# EAGLE design Display-Version (EAGLE 8.7.1)
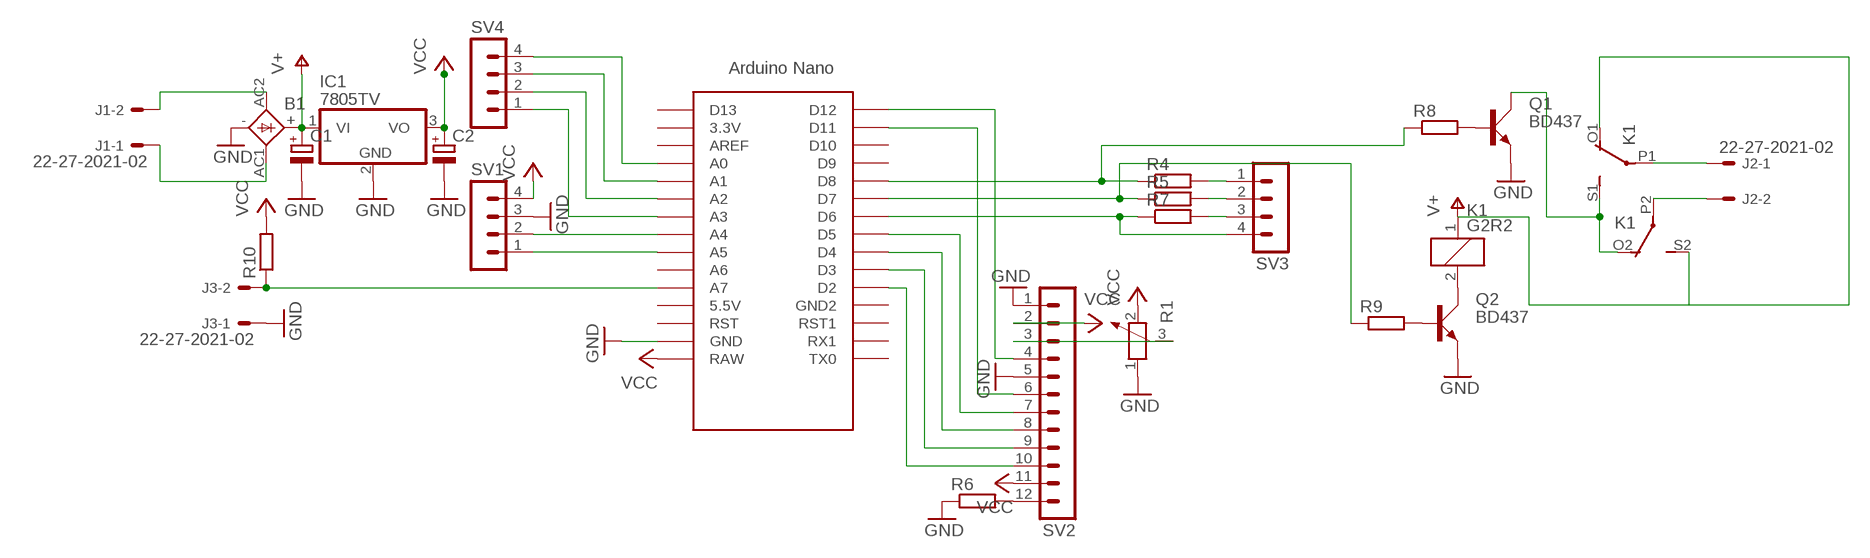
[diagram p0: schematic, sheet 1]

## Parts
B1  FBU4  [FBU4]
C1  CPOL-EUE3.5-10  [E3,5-10]
C2  CPOL-EUE2.5-6  [E2,5-6]
IC1  7805TV  [TO220V]
J1  22-27-2021-02  [6410-02]
J2  22-27-2021-02  [6410-02]
J3  22-27-2021-02  [6410-02]
K1  G2R2  [G2R2]
Q1  BD437  [TO126AV]
Q2  BD437  [TO126AV]
R1  POTENTIOMETER_PT-10S  [PT-10S]
R4  R-EU_R1206W  [R1206W]
R5  R-EU_R1206W  [R1206W]
R6  R-EU_R1206W  [R1206W]
R7  R-EU_R1206W  [R1206W]
R8  R-EU_R1206W  [R1206W]
R9  R-EU_R1206W  [R1206W]
R10  R-EU_R1206W  [R1206W]
SV1  MA04-1  [MA04-1]
SV2  MA12-1  [MA12-1]
SV3  MA04-1  [MA04-1]
SV4  MA04-1  [MA04-1]
U$1  NANO  [NANO]

## Nets
GND: B1.- C1.- C2.- IC1.2(GND) J3.1 Q1.E Q2.E R1.1 R6.1 SV1.3 SV2.1 SV2.5 U$1.GND
N$1: R6.2 SV2.12
N$2: R4.1 R8.1 U$1.D8
N$3: B1.AC2(AC1) J1.2
N$4: B1.AC1(AC2) J1.1
N$5: R5.1 R9.1 U$1.D7
N$6: R4.2 SV3.1
N$7: R7.1 SV3.4 U$1.D6
N$8: R5.2 SV3.2
N$9: R7.2 SV3.3
N$10: J2.1 K1.P1(2:P)
N$11: J2.2 K1.P2(3:P)
N$12: Q1.B R8.2
N$14: K1.2 Q2.C
N$15: Q2.B R9.2
N$16: SV2.10 U$1.D2
N$17: SV2.9 U$1.D3
N$18: SV2.8 U$1.D4
N$19: SV2.7 U$1.D5
N$20: SV2.6 U$1.D11
N$21: SV2.4 U$1.D12
N$22: R1.3 SV2.3
N$23: SV1.1 U$1.A5
N$24: K1.O2(3:O) K1.S1(2:S) Q1.C
N$25: SV1.2 U$1.A4
N$26: SV4.1 U$1.A3
N$27: J3.2 R10.1 U$1.A7
N$28: SV4.2 U$1.A2
N$29: SV4.3 U$1.A1
N$30: SV4.4 U$1.A0
V+: B1.+ C1.+ IC1.1(VI) K1.1 K1.O1(2:O) K1.S2(3:S)
VCC: C2.+ IC1.3(VO) R1.2 R10.2 SV1.4 SV2.2 SV2.11 U$1.RAW
Unconnected: U$1.3.3V U$1.5V(5.5V) U$1.A6 U$1.AREF U$1.D9 U$1.D10 U$1.D13 U$1.GND1(GND2) U$1.ICSP1 U$1.ICSP2 U$1.ICSP3 U$1.ICSP4 U$1.ICSP5 U$1.ICSP6 U$1.RST U$1.RST1 U$1.RX1 U$1.TX0

## Library data of the parts
B1 = rectifier:FBU4: FAGOR RECTIFIER grid 3 x 5 mm
C1 C2 = rcl:CPOL-EU: POLARIZED CAPACITOR, European symbol; SPICEPREFIX: C
IC1 = linear:78*: Positive VOLTAGE REGULATOR Source: http://cache.national.com/ds/LM/LM78L05.pdf http://www.fairchildsemi.com/ds/LM/LM7805.pdf
J1-J3 = con-molex:22-?-02: CONNECTOR wire to board 2.54 mm (.1 inch) pitch header; MF: MOLEX; OC_FARNELL: unknown; OC_NEWARK: unknown
K1 = relay:G2R2: RELAY 2 x switch, Omron; MF: OMRON COMPONENTS USA; MPN: G2R-2-DC6; OC_FARNELL: unknown; OC_NEWARK: 89C5317
Q1 Q2 = transistor-power:BD437: NPN TRANSISTOR
R1 = rcl:POTENTIOMETER_: Potentiometer; SPICEMODEL: POT; SPICEPREFIX: X
R4-R10 = rcl:R-EU_: RESISTOR, European symbol; SPICEPREFIX: R
SV1 SV3 SV4 = con-lstb:MA04-1: PIN HEADER; OC_FARNELL: unknown; OC_NEWARK: unknown
SV2 = con-lstb:MA12-1: PIN HEADER; OC_FARNELL: unknown; OC_NEWARK: unknown
U$1 = Arduino-clone:NANO: Arduino Nano

## Board
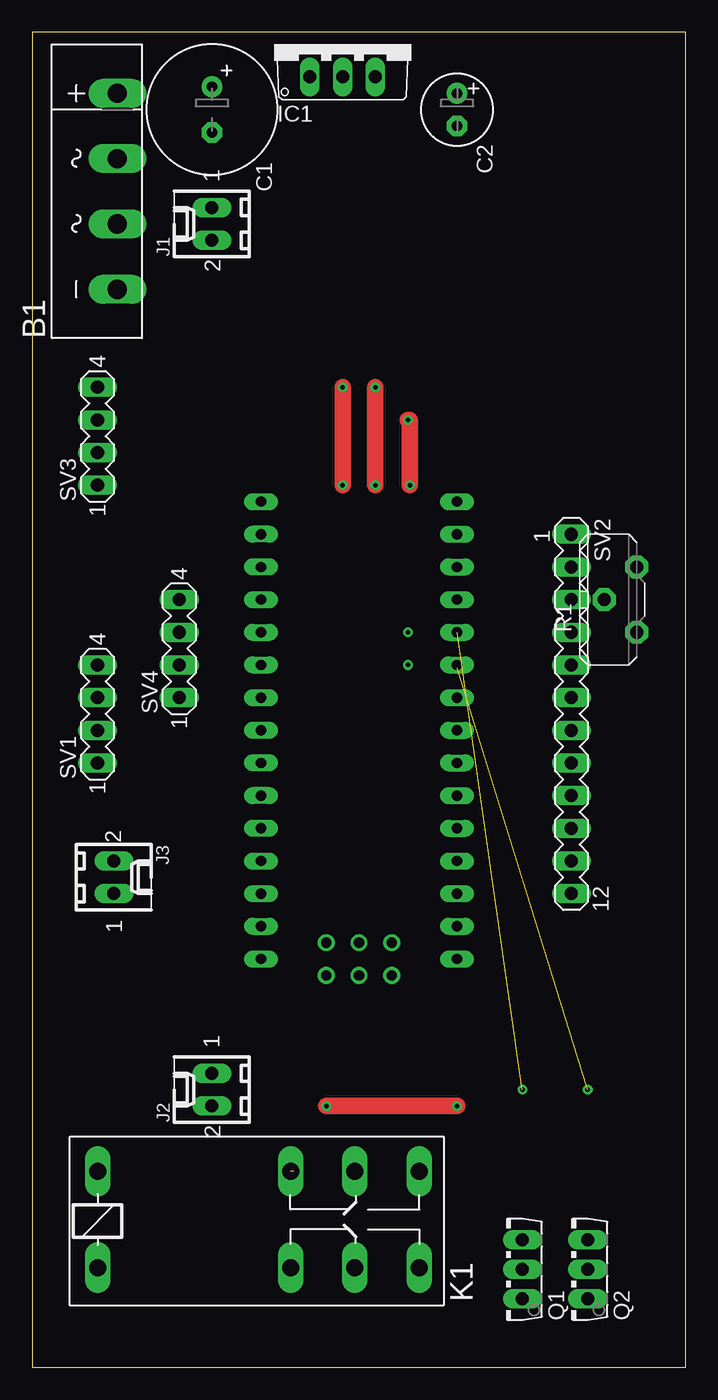
[diagram p1: board, top side]
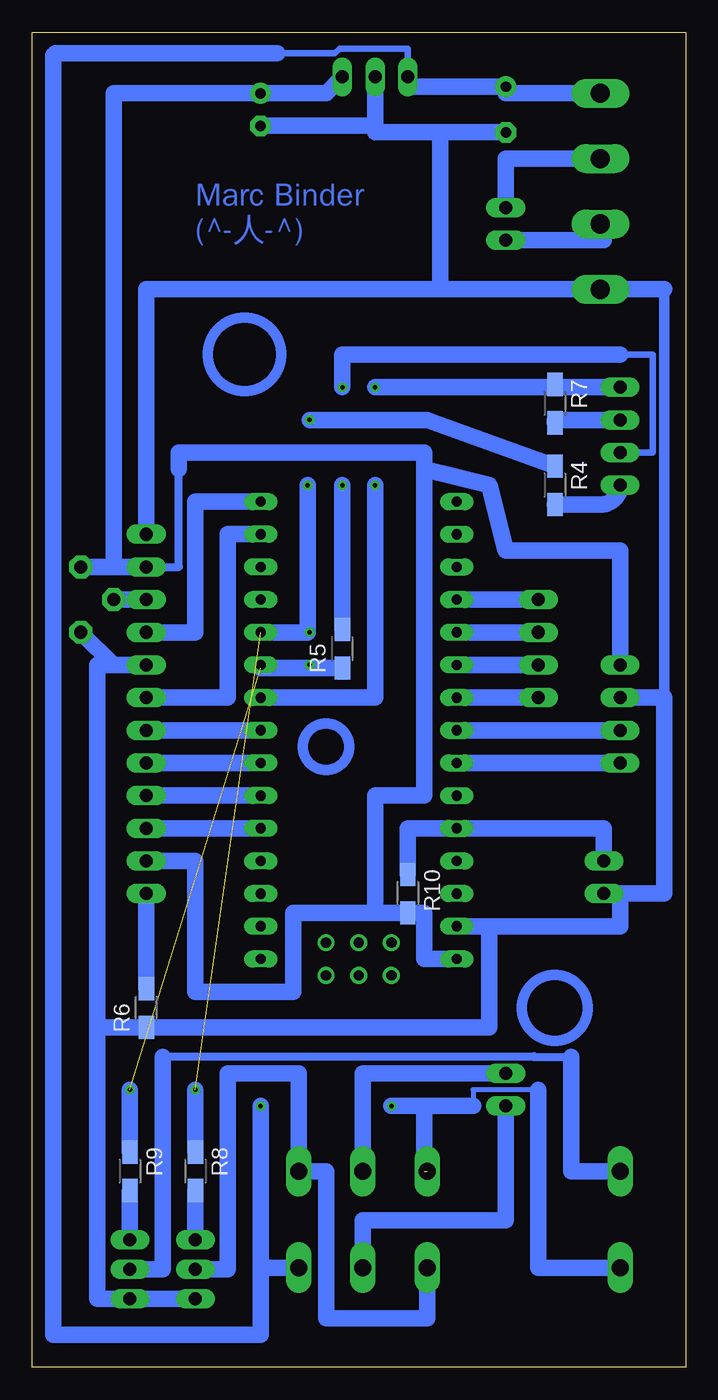
[diagram p2: board, bottom side, seen from below]

Size 50.78 x 103.81 mm. Coordinates in mm from the lower left corner, seen from the top.
Outline: 0,0 50.78,0 50.78,103.81 0,103.81 0,0
Copper layers (1*16): Top 0.035mm / dielectric 1.5mm / Bottom 0.035mm
Design rules "default": minimum track width 6mil, minimum drill 0.35mm, track to track 6mil, track to pad 6mil, pad to pad 6mil, via to via 6mil, smd to smd 6mil, copper to edge 40mil, drill to drill 6mil, minimum pad ring 10mil, minimum via ring 8mil, stop-mask expansion 4mil, vias tented up to drill 0mil, thermal gap 10mil

### Footprints (pad centres in the part's own frame; a part is rotated, then mirrored left to right if it is on the bottom)
FBU4 = drill 1.499 long: + 7.62,-1.54; - -7.62,-1.54; AC1 2.54,-1.54; AC2 -2.54,-1.54
E3,5-10 = drill 0.813 pad 1.6: + -1.778,0 | drill 0.813 pad 1.6 octagon: - 1.778,0
E2,5-6 = drill 0.813 pad 1.6: + -1.27,0 | drill 0.813 pad 1.6 octagon: - 1.27,0
TO220V = drill 1.016 long: 1 -2.54,-2.54; 2 0,-2.54; 3 2.54,-2.54
6410-02 = drill 1.016 long: 1 1.27,0; 2 -1.27,0
G2R2 = drill 1.321 long: 1 -2.54,-3.683; 2 -2.54,3.81; O1 12.471,3.81; O2 12.471,-3.683; P1 17.45,3.81; P2 17.45,-3.683; S1 22.454,3.81; S2 22.454,-3.683
TO126AV = drill 1.016 long: B 2.286,-1.27; C 0,-1.27; E -2.286,-1.27
PT-10S = drill 1.016 pad 1.778 octagon: 1 -2.54,-1.27; 2 2.54,-1.27; 3 0,1.27
R1206W = smd 1.8 x 1.2: 1 -1.499,0; 2 1.499,0
MA04-1 = drill 1.016 long: 1 -3.81,0; 2 -1.27,0; 3 1.27,0; 4 3.81,0
MA12-1 = drill 1.016 long: 1 -13.97,0; 2 -11.43,0; 3 -8.89,0; 4 -6.35,0; 5 -3.81,0; 6 -1.27,0; 7 1.27,0; 8 3.81,0; 9 6.35,0; 10 8.89,0; 11 11.43,0; 12 13.97,0
NANO = drill 0.8 long: 3.3V -10.16,24.13; 5V -10.16,-1.27; A0 -10.16,19.05; A1 -10.16,16.51; A2 -10.16,13.97; A3 -10.16,11.43; A4 -10.16,8.89; A5 -10.16,6.35; A6 -10.16,3.81; A7 -10.16,1.27; AREF -10.16,21.59; D2 5.08,1.27; D3 5.08,3.81; D4 5.08,6.35; D5 5.08,8.89; D6 5.08,11.43; D7 5.08,13.97; D8 5.08,16.51; D9 5.08,19.05; D10 5.08,21.59; D11 5.08,24.13; D12 5.08,26.67; D13 -10.16,26.67; GND -10.16,-6.35; GND1 5.08,-1.27; RAW -10.16,-8.89; RST -10.16,-3.81; RST1 5.08,-3.81; RX1 5.08,-6.35; TX0 5.08,-8.89 | drill 0.8: ICSP1 -5.08,-10.16; ICSP2 -5.08,-7.62; ICSP3 -2.54,-10.16; ICSP4 -2.54,-7.62; ICSP5 0,-10.16; ICSP6 0,-7.62

### Placement (x,y rotation side)
B1  5.08,91.44 90 top
C1  13.97,97.79 270 top
C2  33.02,97.79 270 top
IC1  24.13,102.87 0 top
J1  13.97,88.9 90 top
J2  13.97,21.59 90 top
J3  6.35,38.1 270 top
K1  7.62,11.43 0 top
Q1  36.83,7.62 90 top
Q2  41.91,7.62 90 top
R1  45.72,59.69 90 top
R4  10.16,68.58 270 bottom
R5  26.67,55.88 90 bottom
R6  41.91,27.94 90 bottom
R7  10.16,74.93 270 bottom
R8  38.1,15.24 270 bottom
R9  43.18,15.24 270 bottom
R10  21.59,36.83 270 bottom
SV1  5.08,50.8 90 top
SV2  41.91,50.8 270 top
SV3  5.08,72.39 90 top
SV4  11.43,55.88 90 top
U$1  27.94,40.64 0 top

### Tracks (layer width: path | path; a pad name or v marks a point on that pad's centre or on a via)
GND
  Bottom 0.813: 1.65,83.82 1.65,52.07
  Bottom 1.27: 5.08,36.83 5.08,34.29 15.24,34.29 | 5.08,36.83 J3.1 | U$1.GND 15.24,34.29 | 5.08,36.83 1.65,36.83 1.65,52.07 SV1.3 | 19.05,83.82 B1.- 1.65,83.82 | 19.05,96.01 C1.- | 19.05,83.82 19.05,96.01 | 19.05,96.01 24.13,96.01 24.13,96.52 | IC1.2 24.13,96.52 | C2.- 24.13,96.52 | 15.24,34.29 15.24,26.44 R6.1 45.72,26.44 | 19.05,83.82 41.91,83.82 SV2.1 | R1.1 44.45,54.61 SV2.5 45.72,54.61 45.72,26.44 | Q1.E Q2.E 45.72,5.33 45.72,26.44
N$1
  Bottom 1.27: R6.2 SV2.12
N$2  (via drill 0.35)  (1 unrouted)
  Top 1.27: v29.36,68.58 29.36,73.66 v29.21,73.66
  Bottom 1.27: U$1.D8 29.36,57.15 v29.36,68.58 | v29.21,73.66 20.09,73.66 R4.1 | R8.1 v38.1,21.59
N$3
  Bottom 1.27: J1.2 6.35,87.63 6.35,88.9 B1.AC2
N$4
  Bottom 1.27: J1.1 13.97,93.98 B1.AC1
N$5  (via drill 0.35)  (1 unrouted)
  Bottom 1.27: U$1.D7 33.02,54.38 R5.1 | R9.1 v43.18,21.59
N$6
  Bottom 1.27: SV3.1 arc90 6.58,67.08 R4.2
N$7  (via drill 0.35)
  Top 1.27: v24.13,76.2 v24.13,68.58
  Bottom 1.27: SV3.4 10.16,76.2 | 10.16,76.2 R7.1 | 10.16,76.2 v24.13,76.2 | v24.13,68.58 24.13,52.07 U$1.D6
N$8  (via drill 0.35)
  Top 1.27: v26.67,68.58 v26.67,76.2
  Bottom 0.508: SV3.2 2.54,71.12 2.54,78.74 5.08,78.74
  Bottom 1.27: R5.2 v26.67,68.58 | 5.08,78.74 26.67,78.74 v26.67,76.2
N$9
  Bottom 1.27: SV3.3 10.16,73.66 R7.2
N$10
  Bottom 1.27: K1.P1 25.07,22.86 J2.1
N$11
  Bottom 1.27: K1.P2 25.07,11.43 13.97,11.43 J2.2
N$12
  Bottom 1.27: R8.2 Q1.B
N$14
  Bottom 0.61: 8.89,24.13 11.79,24.13 11.79,24.18 40.64,24.18 40.64,24.13
  Bottom 1.27: Q2.C 40.64,7.62 40.64,24.13 | 8.89,24.13 8.89,15.24 K1.2
N$15
  Bottom 1.27: R9.2 Q2.B
N$16
  Bottom 1.27: SV2.10 U$1.D2
N$17
  Bottom 1.27: SV2.9 U$1.D3
N$18
  Bottom 1.27: SV2.8 U$1.D4
N$19
  Bottom 1.27: SV2.7 U$1.D5
N$20
  Bottom 1.27: SV2.6 35.56,52.07 35.56,64.77 U$1.D11
N$21
  Bottom 1.27: SV2.4 38.1,57.15 38.1,67.31 U$1.D12
N$22
  Bottom 1.27: SV2.3 R1.3
N$23
  Bottom 1.27: U$1.A5 SV1.1
N$24
  Bottom 1.27: Q1.C 35.56,7.62 35.56,22.86 30.07,22.86 K1.S1 27.94,15.24 27.94,3.81 20.09,3.81 K1.O2
N$25
  Bottom 1.27: U$1.A4 SV1.2
N$26
  Bottom 1.27: U$1.A3 SV4.1
N$27
  Bottom 1.27: J3.2 6.35,41.91 U$1.A7 21.59,41.91 R10.1
N$28
  Bottom 1.27: U$1.A2 SV4.2
N$29
  Bottom 1.27: U$1.A1 SV4.3
N$30
  Bottom 1.27: SV4.4 U$1.A0
N$31  (via drill 0.35)
  other vias: 29.21,57.15
N$32  (via drill 0.35)
  other vias: 29.21,54.61
V+  (via drill 0.35)  (1 unrouted)
  Top 1.27: v22.86,20.32 v33.02,20.32
  Bottom 0.406: 11.43,21.59 16.51,21.59 16.51,20.32
  Bottom 0.508: 31.75,102.16 27.25,102.16 26.87,102.54 21.59,102.54 IC1.1
  Bottom 1.27: B1.+ 13.97,99.06 C1.+ 21.59,99.57 IC1.1 | 31.75,102.16 48.97,102.16 49.13,102 49.13,2.54 33.02,2.54 33.02,7.75 | K1.S2 33.02,7.75 | 20.32,15.24 20.32,19.05 20.32,20.32 | 20.32,20.32 v22.86,20.32 | v33.02,20.32 33.02,7.75 | K1.1 11.43,7.75 11.43,21.59 | 16.51,20.32 20.32,20.32
VCC
  Bottom 0.61: SV2.2 39.37,62.23 39.37,69.85
  Bottom 1.27: U$1.RAW 20.32,31.75 20.32,35.33 R10.2 24.13,35.33 | IC1.3 27.94,99.06 C2.+ 44.45,99.06 44.45,62.23 | R1.2 44.45,62.23 | 44.45,62.23 SV2.2 | 24.13,35.33 30.48,35.33 30.48,29.21 38.1,29.21 38.1,39.37 SV2.11 | SV1.4 5.08,63.5 13.97,63.5 15.24,68.58 20.32,69.85 | 20.32,69.85 20.32,44.45 24.13,44.45 24.13,35.33 | 39.37,69.85 39.37,71.12 20.32,71.12 20.32,69.85
(copper drawn outside any net)
  shapes: Bottom circle x3

### Text on the board
Bottom: Marc Binder / (^-人-^)